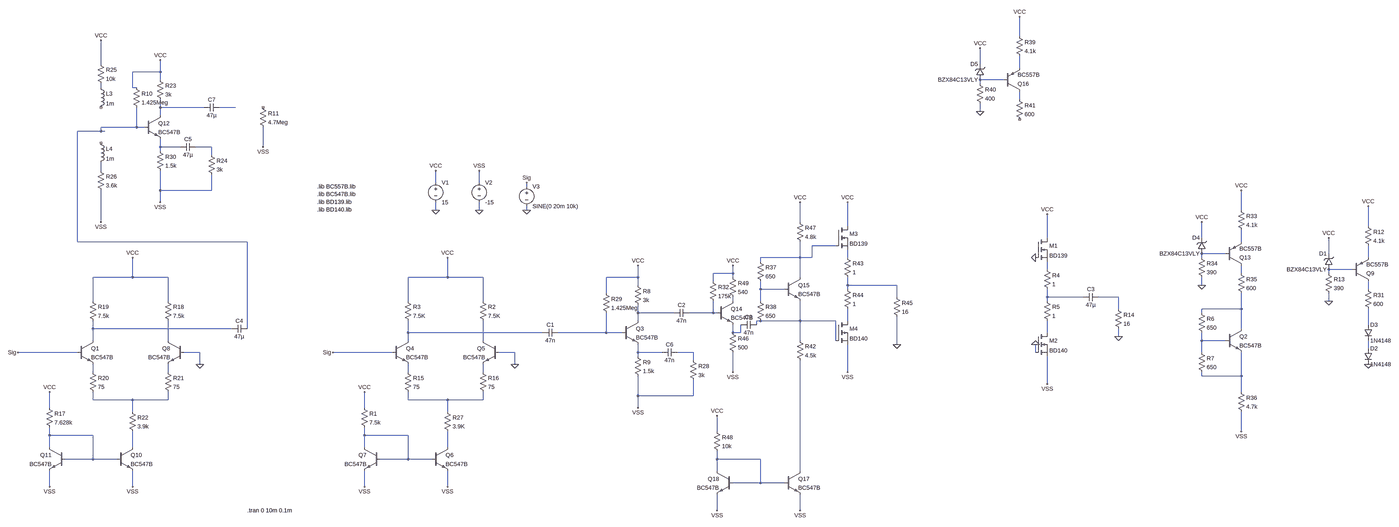
[diagram p0: schematic AudioAmp.asc, whole sheet]
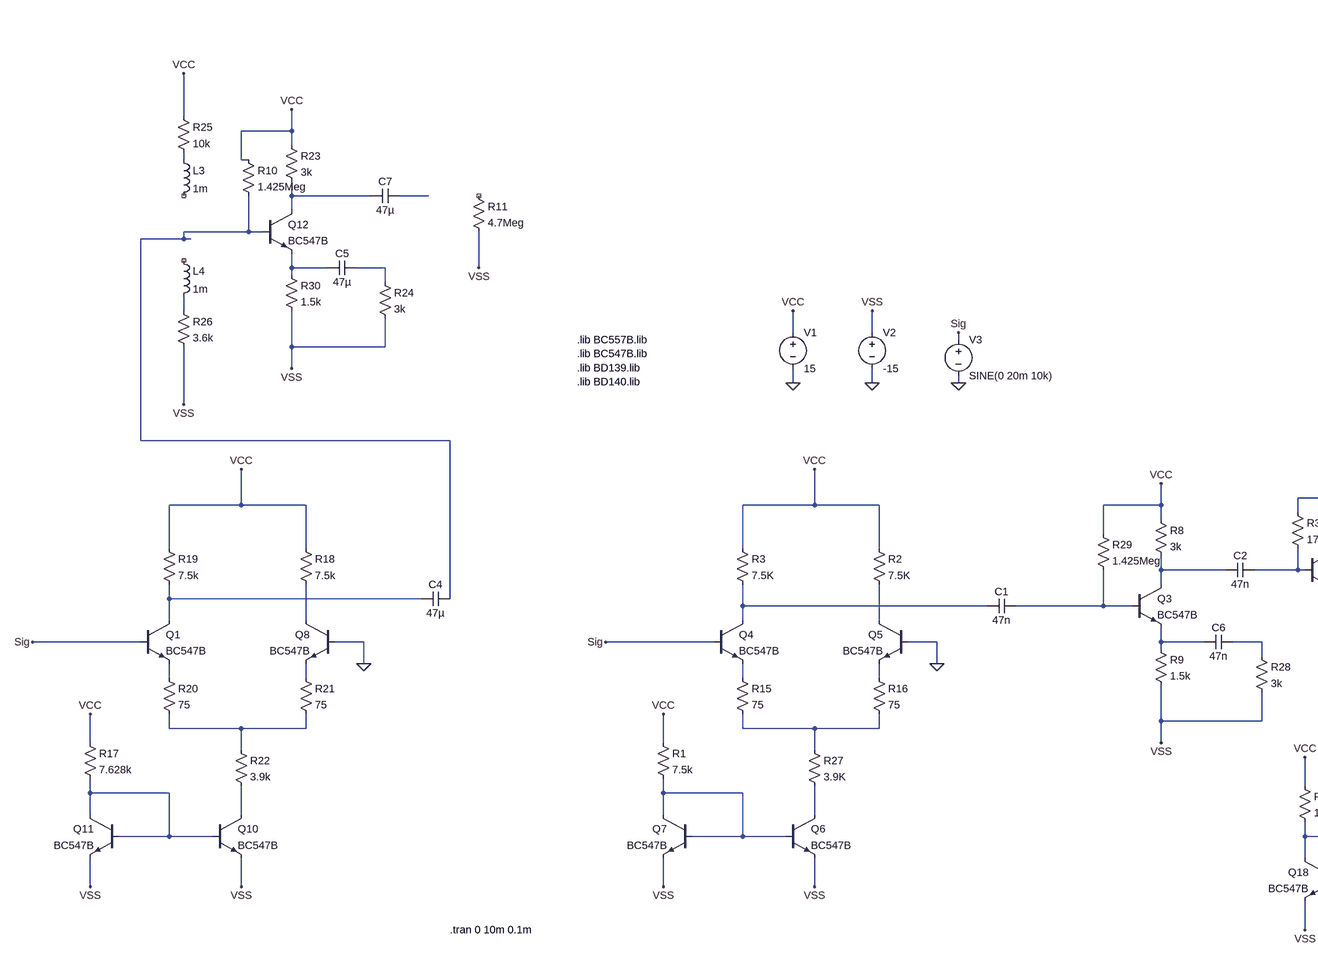
[diagram p1: schematic AudioAmp.asc, part, row 1 of 1, column 1 of 2]
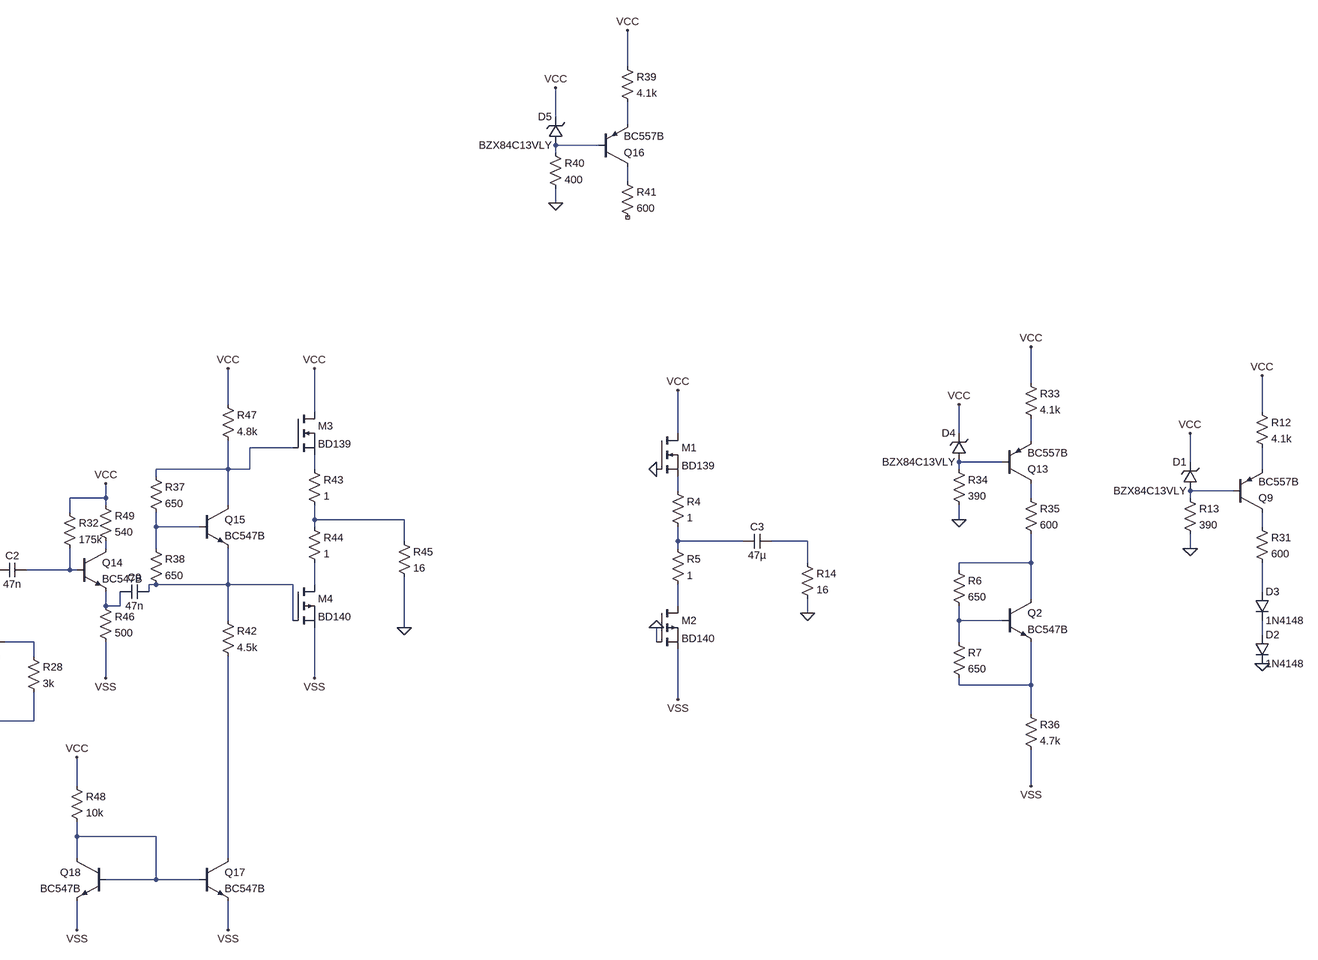
[diagram p2: schematic AudioAmp.asc, part, row 1 of 1, column 2 of 2]
AudioAmp.asc, the LTspice schematic file:
Version 4
SHEET 1 3508 1580
WIRE 1408 -864 1408 -944
WIRE -2672 -752 -2672 -848
WIRE 1248 -752 1248 -816
WIRE 1408 -736 1408 -784
WIRE -2432 -720 -2432 -768
WIRE -2432 -720 -2544 -720
WIRE -2432 -688 -2432 -720
WIRE 1344 -688 1248 -688
WIRE 1248 -672 1248 -688
WIRE -2672 -656 -2672 -672
WIRE -2544 -656 -2544 -720
WIRE -2528 -656 -2544 -656
WIRE 1408 -608 1408 -640
WIRE -2432 -576 -2432 -608
WIRE -2256 -576 -2432 -576
WIRE -2128 -576 -2192 -576
WIRE 1248 -560 1248 -592
WIRE -2432 -544 -2432 -576
WIRE -2528 -496 -2528 -576
WIRE -2528 -496 -2672 -496
WIRE -2496 -496 -2528 -496
WIRE -2672 -480 -2672 -496
WIRE -2672 -480 -2768 -480
WIRE -2656 -480 -2672 -480
WIRE -2432 -416 -2432 -448
WIRE -2352 -416 -2432 -416
WIRE -2224 -416 -2288 -416
WIRE -2016 -416 -2016 -496
WIRE -2432 -400 -2432 -416
WIRE -2224 -384 -2224 -416
WIRE -2672 -320 -2672 -352
WIRE -1136 -272 -1136 -320
WIRE -960 -272 -960 -320
WIRE -768 -256 -768 -272
WIRE -2432 -240 -2432 -320
WIRE -2224 -240 -2224 -304
WIRE -2224 -240 -2432 -240
WIRE -2432 -192 -2432 -240
WIRE -1136 -160 -1136 -192
WIRE -960 -160 -960 -192
WIRE -768 -160 -768 -176
WIRE 2480 -160 2480 -240
WIRE -2672 -112 -2672 -240
WIRE 400 -112 400 -192
WIRE 592 -96 592 -192
WIRE 3392 -96 3392 -176
WIRE 1520 -48 1520 -144
WIRE 2320 -48 2320 -112
WIRE -2768 -32 -2768 -480
WIRE -2080 -32 -2768 -32
WIRE 2480 -32 2480 -80
WIRE 544 -16 448 -16
WIRE 2416 16 2320 16
WIRE 3232 16 3232 -48
WIRE 400 32 400 -32
WIRE 400 32 240 32
WIRE 448 32 448 -16
WIRE 448 32 400 32
WIRE 592 32 592 0
WIRE 2320 32 2320 16
WIRE 3392 32 3392 -16
WIRE 240 48 240 32
WIRE 1520 80 1520 48
WIRE 3328 80 3232 80
WIRE 128 96 128 64
WIRE 128 96 48 96
WIRE 2480 96 2480 64
WIRE 3232 96 3232 80
WIRE -2544 112 -2544 32
WIRE -2544 112 -2704 112
WIRE -2400 112 -2544 112
WIRE -1088 112 -1088 32
WIRE -1088 112 -1248 112
WIRE -944 112 -1088 112
WIRE -256 112 -256 64
WIRE -256 112 -384 112
WIRE 128 112 128 96
WIRE 400 112 400 32
WIRE 48 128 48 96
WIRE -256 144 -256 112
WIRE 592 144 592 112
WIRE 880 144 592 144
WIRE 2320 144 2320 112
WIRE 240 160 240 128
WIRE 336 160 240 160
WIRE 592 160 592 144
WIRE 3392 160 3392 128
WIRE -384 176 -384 112
WIRE 880 192 880 144
WIRE 1520 192 1520 160
WIRE 1664 192 1520 192
WIRE 1808 192 1728 192
WIRE -2704 208 -2704 112
WIRE -2400 208 -2400 112
WIRE -1248 208 -1248 112
WIRE -944 208 -944 112
WIRE 128 208 128 192
WIRE 240 208 240 160
WIRE 1520 208 1520 192
WIRE 3232 208 3232 176
WIRE 1808 240 1808 192
WIRE 2480 240 2480 176
WIRE 2480 240 2320 240
WIRE -256 256 -256 224
WIRE -112 256 -256 256
WIRE 48 256 48 208
WIRE 48 256 -48 256
WIRE 64 256 48 256
WIRE 2320 256 2320 240
WIRE -256 288 -256 256
WIRE 240 288 224 288
WIRE 400 288 400 208
WIRE 400 288 240 288
WIRE 544 288 400 288
WIRE 592 288 592 240
WIRE 224 304 224 288
WIRE 3392 304 3392 240
WIRE -2704 320 -2704 288
WIRE -2144 320 -2704 320
WIRE -2080 320 -2080 -32
WIRE 2480 320 2480 240
WIRE -1248 336 -1248 288
WIRE -704 336 -1248 336
WIRE -384 336 -384 256
WIRE -384 336 -640 336
WIRE -320 336 -384 336
WIRE 128 336 128 304
WIRE 160 336 160 304
WIRE 160 336 128 336
WIRE 1520 336 1520 288
WIRE 1808 352 1808 320
WIRE -2704 368 -2704 320
WIRE -2400 368 -2400 288
WIRE -1248 368 -1248 336
WIRE -944 368 -944 288
WIRE 400 368 400 288
WIRE 544 368 544 288
WIRE 2320 368 2320 336
WIRE 2416 368 2320 368
WIRE 880 384 880 272
WIRE 3392 400 3392 368
WIRE -2768 416 -3008 416
WIRE -2272 416 -2336 416
WIRE -1312 416 -1552 416
WIRE -816 416 -880 416
WIRE -256 416 -256 384
WIRE -160 416 -256 416
WIRE -32 416 -96 416
WIRE 1472 416 1472 384
WIRE 2320 416 2320 368
WIRE -256 432 -256 416
WIRE -32 448 -32 416
WIRE -2272 464 -2272 416
WIRE -816 464 -816 416
WIRE -2704 496 -2704 464
WIRE -2400 496 -2400 464
WIRE -1248 496 -1248 464
WIRE -944 496 -944 464
WIRE 128 496 128 416
WIRE 592 496 592 384
WIRE 2320 512 2320 496
WIRE 2480 512 2480 416
WIRE 2480 512 2320 512
WIRE 1520 544 1520 432
WIRE 2480 576 2480 512
WIRE -256 592 -256 512
WIRE -32 592 -32 528
WIRE -32 592 -256 592
WIRE -2704 608 -2704 576
WIRE -2544 608 -2704 608
WIRE -2400 608 -2400 576
WIRE -2400 608 -2544 608
WIRE -1248 608 -1248 576
WIRE -1088 608 -1248 608
WIRE -944 608 -944 576
WIRE -944 608 -1088 608
WIRE -2880 640 -2880 576
WIRE -1424 640 -1424 576
WIRE -256 640 -256 592
WIRE -2544 656 -2544 608
WIRE -1088 656 -1088 608
WIRE 64 736 64 672
WIRE 2480 736 2480 656
WIRE -2880 752 -2880 720
WIRE -2704 752 -2880 752
WIRE -1424 752 -1424 720
WIRE -1248 752 -1424 752
WIRE -2880 800 -2880 752
WIRE -2544 800 -2544 736
WIRE -1424 800 -1424 752
WIRE -1088 800 -1088 736
WIRE -2704 848 -2704 752
WIRE -2704 848 -2816 848
WIRE -2608 848 -2704 848
WIRE -1248 848 -1248 752
WIRE -1248 848 -1360 848
WIRE -1152 848 -1248 848
WIRE 64 848 64 816
WIRE 240 848 64 848
WIRE 64 896 64 848
WIRE 400 896 400 448
WIRE 240 944 240 848
WIRE 240 944 128 944
WIRE 336 944 240 944
WIRE -2880 960 -2880 896
WIRE -2544 960 -2544 896
WIRE -1424 960 -1424 896
WIRE -1088 960 -1088 896
WIRE 64 1056 64 992
WIRE 400 1056 400 992
FLAG -960 -160 0
FLAG -1136 -160 0
FLAG -1136 -320 VCC
FLAG -960 -320 VSS
FLAG -816 464 0
FLAG 3232 208 0
FLAG 1808 352 0
FLAG -1088 32 VCC
FLAG -256 64 VCC
FLAG 3392 -176 VCC
FLAG 1520 -144 VCC
FLAG -1424 576 VCC
FLAG -1088 960 VSS
FLAG -256 640 VSS
FLAG 1520 544 VSS
FLAG 3232 -48 VCC
FLAG -1424 960 VSS
FLAG -768 -160 0
FLAG -2272 464 0
FLAG -2544 32 VCC
FLAG -2880 576 VCC
FLAG -2544 960 VSS
FLAG -2880 960 VSS
FLAG -768 -272 Sig
FLAG -1552 416 Sig
FLAG -3008 416 Sig
FLAG -2672 -848 VCC
FLAG -2432 -768 VCC
FLAG -2432 -192 VSS
FLAG -2672 -112 VSS
FLAG 2320 144 0
FLAG 2480 -240 VCC
FLAG 2320 -112 VCC
FLAG 2480 736 VSS
FLAG 1472 32 0
FLAG 1472 384 0
FLAG -2016 -416 VSS
FLAG 3392 464 0
FLAG 128 64 VCC
FLAG 1248 -560 0
FLAG 1408 -944 VCC
FLAG 1248 -816 VCC
FLAG 592 -192 VCC
FLAG 592 496 VSS
FLAG 128 496 VSS
FLAG 64 672 VCC
FLAG 400 1056 VSS
FLAG 64 1056 VSS
FLAG 400 -192 VCC
FLAG 880 384 0
SYMBOL npn 2416 320 R0
SYMATTR InstName Q2
SYMATTR Value BC547B
SYMBOL npn -320 288 R0
SYMATTR InstName Q3
SYMATTR Value BC547B
SYMBOL npn -1312 368 R0
SYMATTR InstName Q4
SYMATTR Value BC547B
SYMBOL npn -880 368 M0
SYMATTR InstName Q5
SYMATTR Value BC547B
SYMBOL npn -1152 800 R0
SYMATTR InstName Q6
SYMATTR Value BC547B
SYMBOL npn -1360 800 M0
SYMATTR InstName Q7
SYMATTR Value BC547B
SYMBOL pnp 3328 128 M180
SYMATTR InstName Q9
SYMATTR Value BC557B
SYMBOL res -1440 624 R0
SYMATTR InstName R1
SYMATTR Value 7.5k
SYMBOL res -960 192 R0
SYMATTR InstName R2
SYMATTR Value 7.5K
SYMBOL res -1264 192 R0
SYMATTR InstName R3
SYMATTR Value 7.5K
SYMBOL res 1504 64 R0
SYMATTR InstName R4
SYMATTR Value 1
SYMBOL res 1504 192 R0
SYMATTR InstName R5
SYMATTR Value 1
SYMBOL res 2304 240 R0
SYMATTR InstName R6
SYMATTR Value 650
SYMBOL res 2304 400 R0
SYMATTR InstName R7
SYMATTR Value 650
SYMBOL res -272 128 R0
SYMATTR InstName R8
SYMATTR Value 3k
SYMBOL res -272 416 R0
SYMATTR InstName R9
SYMATTR Value 1.5k
SYMBOL res 3376 -112 R0
SYMATTR InstName R12
SYMATTR Value 4.1k
SYMBOL res 3216 80 R0
SYMATTR InstName R13
SYMATTR Value 390
SYMBOL cap -48 240 R90
WINDOW 0 0 32 VBottom 2
WINDOW 3 32 32 VTop 2
SYMATTR InstName C2
SYMATTR Value 47n
SYMBOL cap 1728 176 R90
WINDOW 0 0 32 VBottom 2
WINDOW 3 32 32 VTop 2
SYMATTR InstName C3
SYMATTR Value 47µ
SYMBOL res 1792 224 R0
SYMATTR InstName R14
SYMATTR Value 16
SYMBOL voltage -1136 -288 R0
SYMATTR InstName V1
SYMATTR Value 15
SYMBOL voltage -960 -288 R0
SYMATTR InstName V2
SYMATTR Value -15
SYMBOL zener 3248 80 R180
WINDOW 0 24 64 Left 2
WINDOW 3 24 0 Left 2
SYMATTR InstName D1
SYMATTR Value BZX84C13VLY
SYMBOL res -1264 480 R0
SYMATTR InstName R15
SYMATTR Value 75
SYMBOL res -960 480 R0
SYMATTR InstName R16
SYMATTR Value 75
SYMBOL voltage -768 -272 R0
WINDOW 123 0 0 Left 0
WINDOW 39 0 0 Left 0
SYMATTR InstName V3
SYMATTR Value SINE(0 20m 10k)
SYMBOL nmos 1472 -48 R0
SYMATTR InstName M1
SYMATTR Value BD139
SYMATTR Prefix X
SYMBOL pmos 1472 336 R0
SYMATTR InstName M2
SYMATTR Value BD140
SYMATTR Prefix X
SYMBOL npn -2768 368 R0
SYMATTR InstName Q1
SYMATTR Value BC547B
SYMBOL npn -2336 368 M0
SYMATTR InstName Q8
SYMATTR Value BC547B
SYMBOL npn -2608 800 R0
SYMATTR InstName Q10
SYMATTR Value BC547B
SYMBOL npn -2816 800 M0
SYMATTR InstName Q11
SYMATTR Value BC547B
SYMBOL res -2896 624 R0
SYMATTR InstName R17
SYMATTR Value 7.628k
SYMBOL res -2416 192 R0
SYMATTR InstName R18
SYMATTR Value 7.5k
SYMBOL res -2720 192 R0
SYMATTR InstName R19
SYMATTR Value 7.5k
SYMBOL res -2720 480 R0
SYMATTR InstName R20
SYMATTR Value 75
SYMBOL res -2416 480 R0
SYMATTR InstName R21
SYMATTR Value 75
SYMBOL res -2560 640 R0
SYMATTR InstName R22
SYMATTR Value 3.9k
SYMBOL npn -2496 -544 R0
SYMATTR InstName Q12
SYMATTR Value BC547B
SYMBOL res -2448 -704 R0
SYMATTR InstName R23
SYMATTR Value 3k
SYMBOL res -2240 -400 R0
SYMATTR InstName R24
SYMATTR Value 3k
SYMBOL res -2688 -768 R0
SYMATTR InstName R25
SYMATTR Value 10k
SYMBOL res -2688 -336 R0
SYMATTR InstName R26
SYMATTR Value 3.6k
SYMBOL res -1104 640 R0
SYMATTR InstName R27
SYMATTR Value 3.9K
SYMBOL cap -2080 304 R90
WINDOW 0 0 32 VBottom 2
WINDOW 3 32 32 VTop 2
SYMATTR InstName C4
SYMATTR Value 47µ
SYMBOL ind -2688 -672 R0
SYMATTR InstName L3
SYMATTR Value 1m
SYMBOL ind -2688 -448 R0
SYMATTR InstName L4
SYMATTR Value 1m
SYMBOL res -2448 -416 R0
SYMATTR InstName R30
SYMATTR Value 1.5k
SYMBOL cap -2288 -432 R90
WINDOW 0 0 32 VBottom 2
WINDOW 3 32 32 VTop 2
SYMATTR InstName C5
SYMATTR Value 47µ
SYMBOL res -48 432 R0
SYMATTR InstName R28
SYMATTR Value 3k
SYMBOL cap -96 400 R90
WINDOW 0 0 32 VBottom 2
WINDOW 3 32 32 VTop 2
SYMATTR InstName C6
SYMATTR Value 47n
SYMBOL cap -640 320 R90
WINDOW 0 0 32 VBottom 2
WINDOW 3 32 32 VTop 2
SYMATTR InstName C1
SYMATTR Value 47n
SYMBOL res -400 160 R0
SYMATTR InstName R29
SYMATTR Value 1.425Meg
SYMBOL res 3376 144 R0
SYMATTR InstName R31
SYMATTR Value 600
SYMBOL diode 3376 400 R0
SYMATTR InstName D2
SYMATTR Value 1N4148
SYMBOL diode 3376 304 R0
SYMATTR InstName D3
SYMATTR Value 1N4148
SYMBOL pnp 2416 64 M180
SYMATTR InstName Q13
SYMATTR Value BC557B
SYMBOL res 2464 -176 R0
SYMATTR InstName R33
SYMATTR Value 4.1k
SYMBOL res 2304 16 R0
SYMATTR InstName R34
SYMATTR Value 390
SYMBOL zener 2336 16 R180
WINDOW 0 24 64 Left 2
WINDOW 3 24 0 Left 2
SYMATTR InstName D4
SYMATTR Value BZX84C13VLY
SYMBOL res 2464 80 R0
SYMATTR InstName R35
SYMATTR Value 600
SYMBOL res 2464 560 R0
SYMATTR InstName R36
SYMATTR Value 4.7k
SYMBOL res -2544 -672 R0
SYMATTR InstName R10
SYMATTR Value 1.425Meg
SYMBOL res -2032 -592 R0
SYMATTR InstName R11
SYMATTR Value 4.7Meg
SYMBOL cap -2192 -592 R90
WINDOW 0 0 32 VBottom 2
WINDOW 3 32 32 VTop 2
SYMATTR InstName C7
SYMATTR Value 47µ
SYMBOL npn 64 208 R0
SYMATTR InstName Q14
SYMATTR Value BC547B
SYMBOL res 32 112 R0
SYMATTR InstName R32
SYMATTR Value 175k
SYMBOL npn 336 112 R0
SYMATTR InstName Q15
SYMATTR Value BC547B
SYMBOL res 224 32 R0
SYMATTR InstName R37
SYMATTR Value 650
SYMBOL res 224 192 R0
SYMATTR InstName R38
SYMATTR Value 650
SYMBOL pnp 1344 -640 M180
SYMATTR InstName Q16
SYMATTR Value BC557B
SYMBOL res 1392 -880 R0
SYMATTR InstName R39
SYMATTR Value 4.1k
SYMBOL res 1232 -688 R0
SYMATTR InstName R40
SYMATTR Value 400
SYMBOL zener 1264 -688 R180
WINDOW 0 24 64 Left 2
WINDOW 3 24 0 Left 2
SYMATTR InstName D5
SYMATTR Value BZX84C13VLY
SYMBOL res 1392 -624 R0
SYMATTR InstName R41
SYMATTR Value 600
SYMBOL res 384 352 R0
SYMATTR InstName R42
SYMATTR Value 4.5k
SYMBOL res 576 16 R0
SYMATTR InstName R43
SYMATTR Value 1
SYMBOL res 576 144 R0
SYMATTR InstName R44
SYMATTR Value 1
SYMBOL res 864 176 R0
SYMATTR InstName R45
SYMATTR Value 16
SYMBOL nmos 544 -96 R0
SYMATTR InstName M3
SYMATTR Value BD139
SYMATTR Prefix X
SYMBOL pmos 544 288 R0
SYMATTR InstName M4
SYMATTR Value BD140
SYMATTR Prefix X
SYMBOL res 112 320 R0
SYMATTR InstName R46
SYMATTR Value 500
SYMBOL cap 224 288 R90
WINDOW 0 0 32 VBottom 2
WINDOW 3 32 32 VTop 2
SYMATTR InstName C9
SYMATTR Value 47n
SYMBOL res 384 -128 R0
SYMATTR InstName R47
SYMATTR Value 4.8k
SYMBOL npn 336 896 R0
SYMATTR InstName Q17
SYMATTR Value BC547B
SYMBOL npn 128 896 M0
SYMATTR InstName Q18
SYMATTR Value BC547B
SYMBOL res 48 720 R0
SYMATTR InstName R48
SYMATTR Value 10k
SYMBOL res 112 96 R0
SYMATTR InstName R49
SYMATTR Value 540
TEXT -1616 -256 Left 2 !.lib BC557B.lib\n.lib BC547B.lib\n.lib BD139.lib\n.lib BD140.lib
TEXT -2080 1056 Left 2 !.tran 0 10m 0.1m

The netlist it stands for:
* AudioAmp.asc
Q2 N025 N038 N046 0 BC547B
Q3 N026 N033 N040 0 BC547B
Q4 N032 Sig N044 0 BC547B
Q5 N037 0 N045 0 BC547B
Q6 N052 N050 VSS 0 BC547B
Q7 N050 N050 VSS 0 BC547B
Q9 N021 N017 N015 0 BC557B
R1 VCC N050 7.5k
R2 VCC N037 7.5K
R3 VCC N032 7.5K
R4 N016 N022 1
R5 N022 N035 1
R6 N025 N038 650
R7 N038 N046 650
R8 VCC N026 3k
R9 N040 VSS 1.5k
R12 VCC N015 4.1k
R13 N017 0 390
C2 N027 N026 47n
C3 N023 N022 47µ
R14 N023 0 16
V1 VCC 0 15
V2 VSS 0 -15
D1 N017 VCC BZX84C13VLY
R15 N044 N048 75
R16 N045 N048 75
V3 Sig 0 SINE(0 20m 10k)
XM1 VCC 0 N016 BD139  ; pins D G S
XM2 N035 0 VSS BD140  ; pins D G S
Q1 N031 Sig N042 0 BC547B
Q8 N036 0 N043 0 BC547B
Q10 N051 N049 VSS 0 BC547B
Q11 N049 N049 VSS 0 BC547B
R17 VCC N049 7.628k
R18 VCC N036 7.5k
R19 VCC N031 7.5k
R20 N042 N047 75
R21 N043 N047 75
R22 N047 N051 3.9k
Q12 N005 N007 N008 0 BC547B
R23 VCC N005 3k
R24 N009 VSS 3k
R25 VCC N003 10k
R26 N010 VSS 3.6k
R27 N048 N052 3.9K
C4 N007 N031 47µ
L3 N003 NC_01 1m
L4 NC_02 N010 1m
R30 N008 VSS 1.5k
C5 N009 N008 47µ
R28 N041 VSS 3k
C6 N041 N040 47n
C1 N033 N032 47n
R29 VCC N033 1.425Meg
R31 N021 N030 600
D2 N039 0 1N4148
D3 N030 N039 1N4148
Q13 N018 N013 N011 0 BC557B
R33 VCC N011 4.1k
R34 N013 0 390
D4 N013 VCC BZX84C13VLY
R35 N018 N025 600
R36 N046 VSS 4.7k
R10 VCC N007 1.425Meg
R11 NC_03 VSS 4.7Meg
C7 N006 N005 47µ
Q14 N024 N027 N034 0 BC547B
R32 VCC N027 175k
Q15 N012 N020 N028 0 BC547B
R37 N012 N020 650
R38 N020 N028 650
Q16 N004 N002 N001 0 BC557B
R39 VCC N001 4.1k
R40 N002 0 400
D5 N002 VCC BZX84C13VLY
R41 N004 NC_04 600
R42 N028 N054 4.5k
R43 N014 N019 1
R44 N019 N029 1
R45 N019 0 16
XM3 VCC N012 N014 BD139  ; pins D G S
XM4 N029 N028 VSS BD140  ; pins D G S
R46 N034 VSS 500
C9 N028 N034 47n
R47 VCC N012 4.8k
Q17 N054 N053 VSS 0 BC547B
Q18 N053 N053 VSS 0 BC547B
R48 VCC N053 10k
R49 VCC N024 540
.model D D
.lib standard.dio
.model NPN NPN
.model PNP PNP
.lib standard.bjt
.lib BC557B.lib
.lib BC547B.lib
.lib BD139.lib
.lib BD140.lib
.tran 0 10m 0.1m
.backanno
.end